# Altium schematic sheet 测试板原理图.SchDoc
size A1
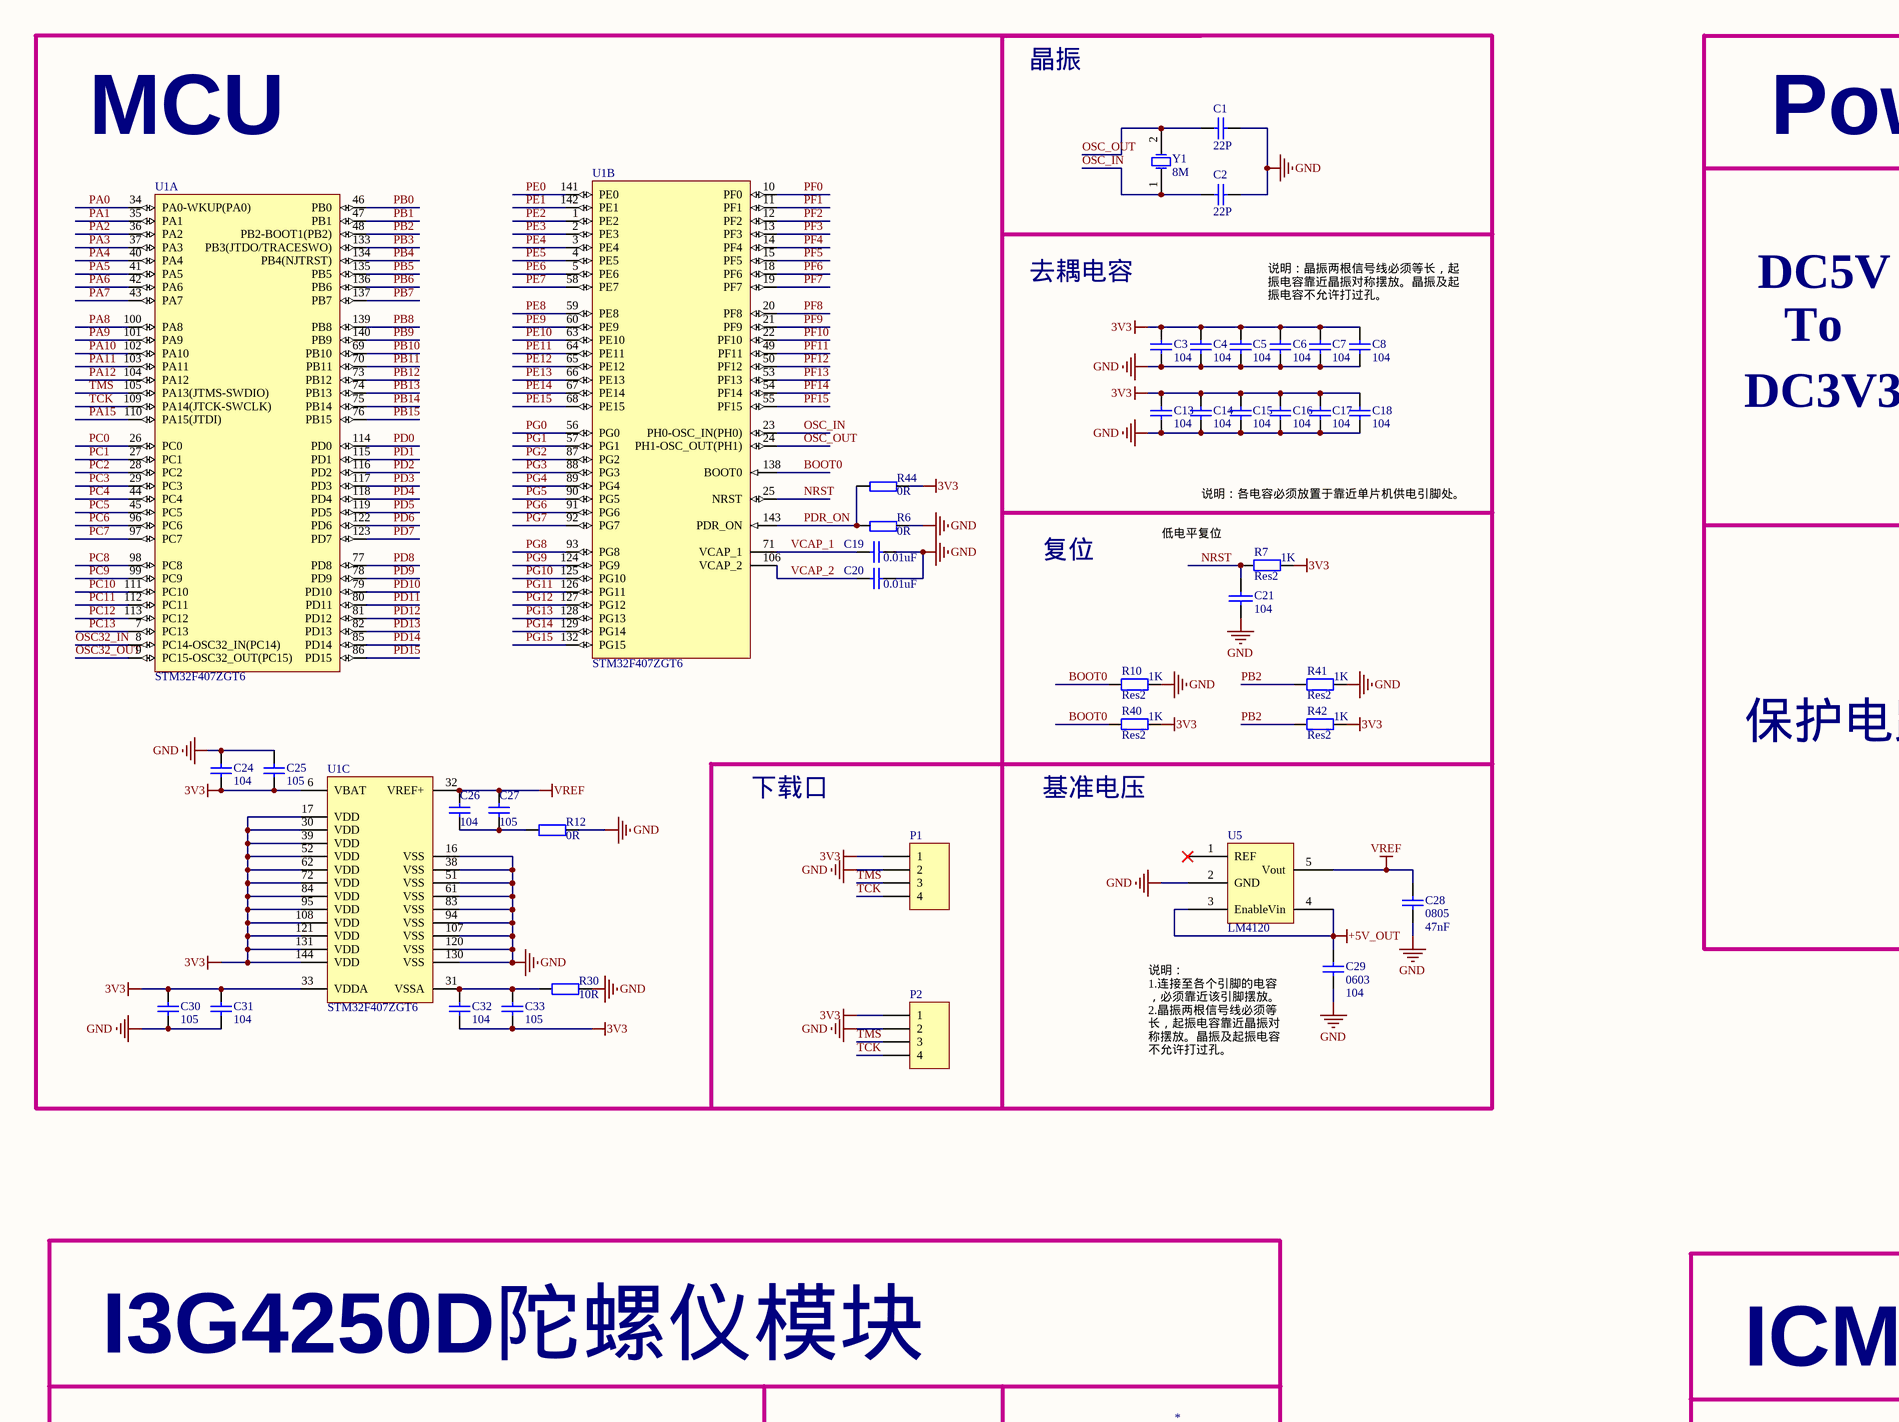
[diagram p0: 测试板原理图.SchDoc, top left]
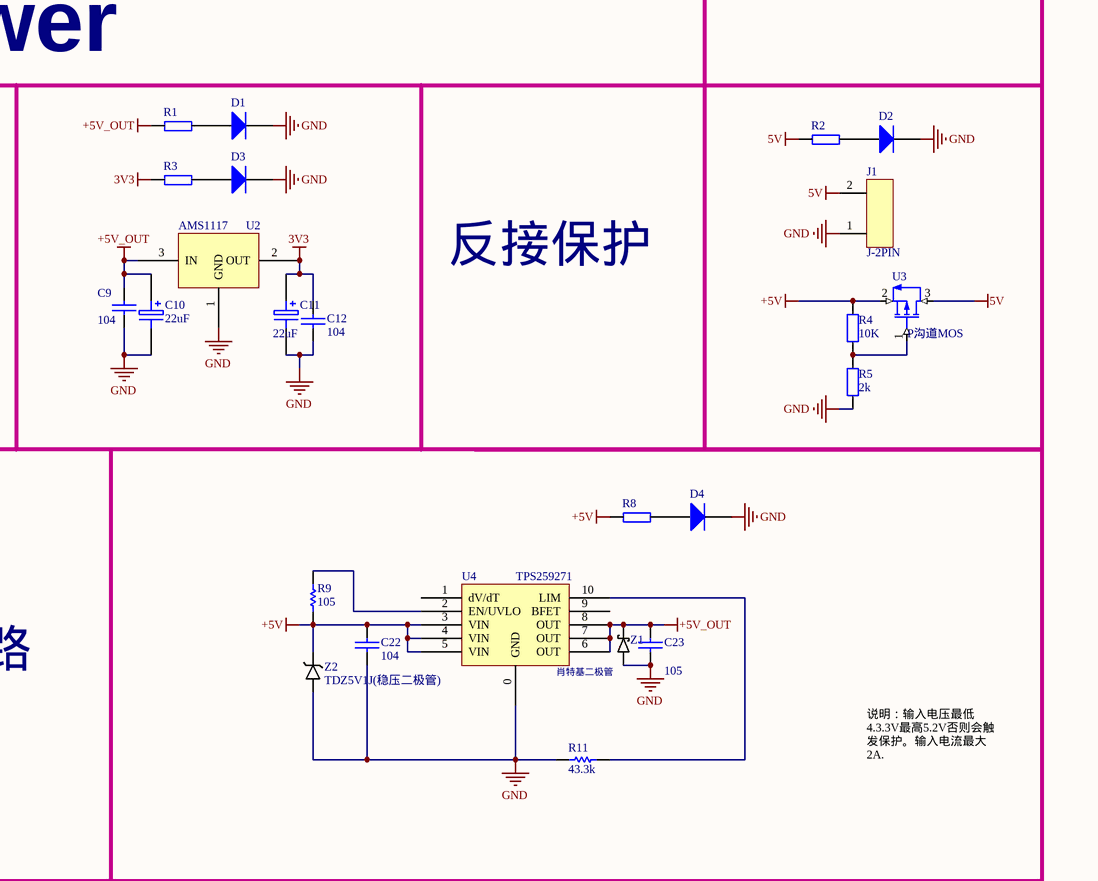
[diagram p1: 测试板原理图.SchDoc, top right]
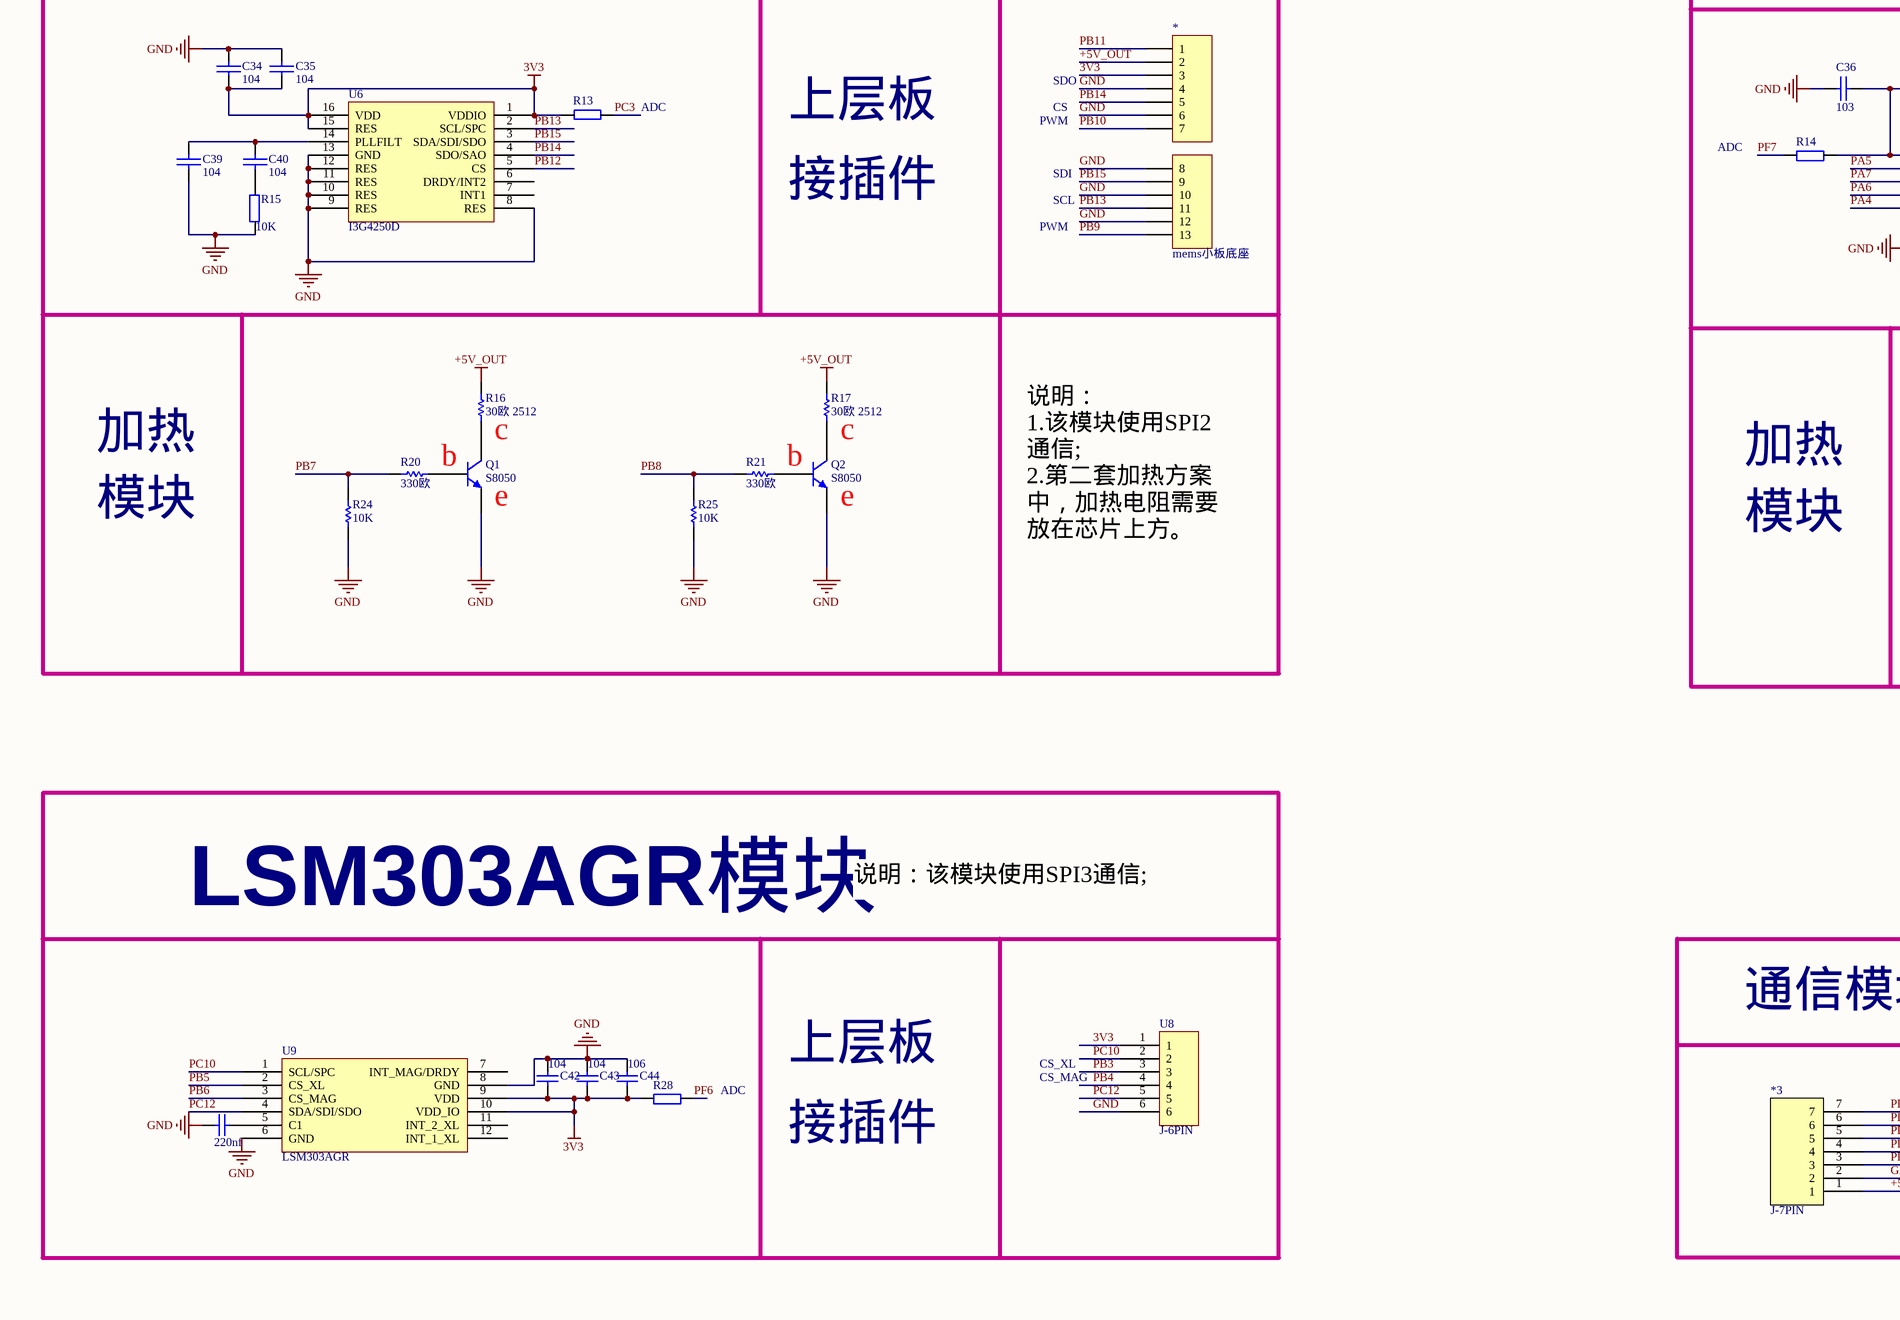
[diagram p2: 测试板原理图.SchDoc, bottom left]
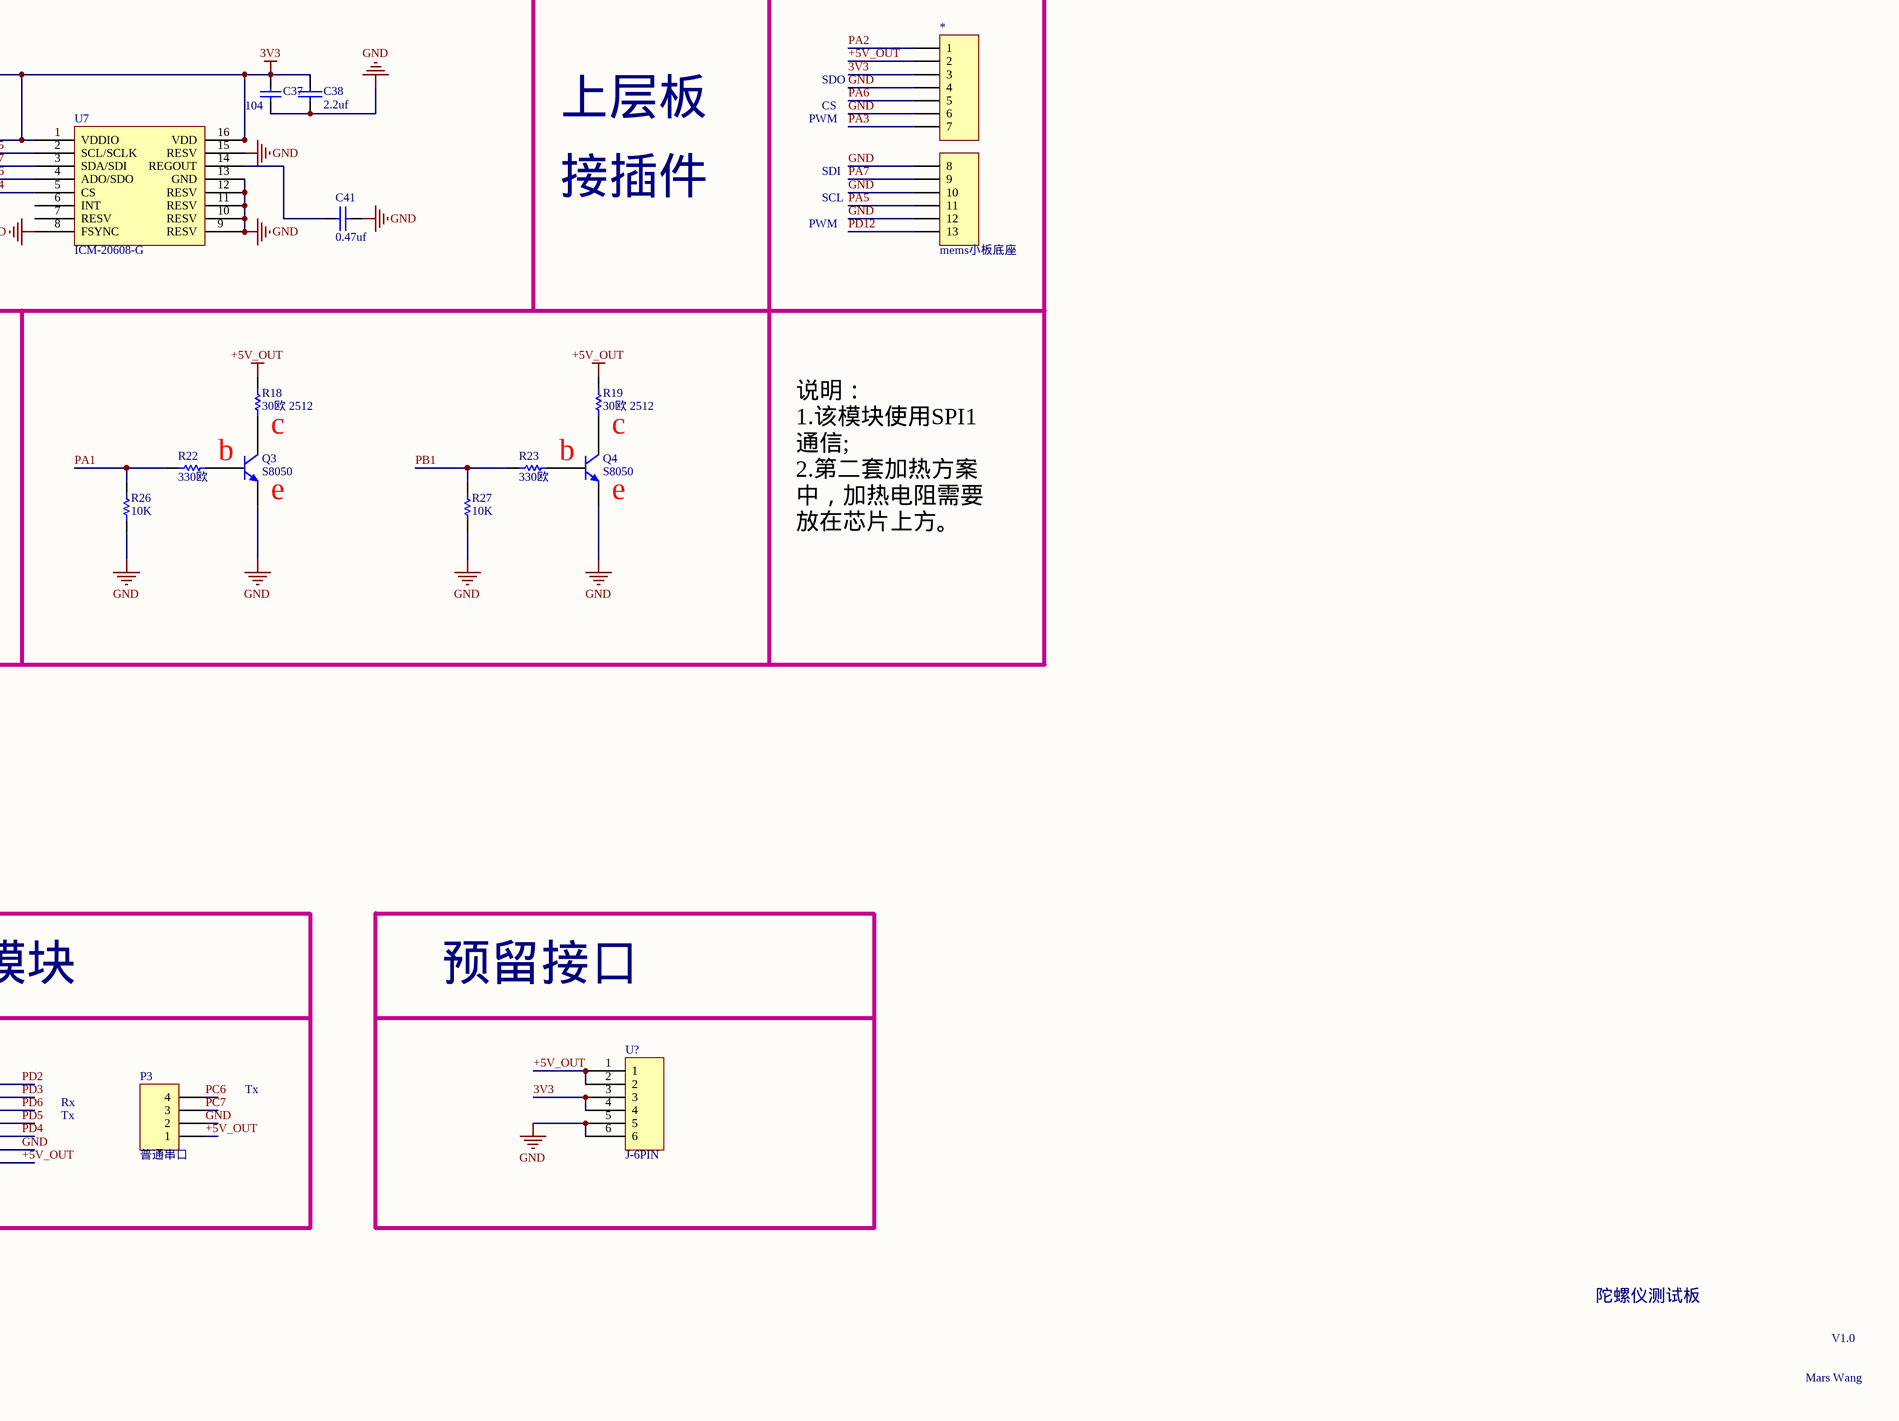
[diagram p3: 测试板原理图.SchDoc, bottom right]

## Parts
(Parts that share a designator on the sheet are numbered #1, #2 ... from top to bottom, then left to right.)
*3  J-7PIN  [HDR1X7排座]
*#1  mems小板底座  [mems小板底座]
*#2  mems小板底座  [mems小板底座]
C1  22P  [C-0603C]
C2  22P  [C-0603C]
C3  104  [C-0603C]
C4  104  [C-0603C]
C5  104  [C-0603C]
C6  104  [C-0603C]
C7  104  [C-0603C]
C8  104  [C-0603C]
C9  104  [C-0603C]
C10  22uF  [C-0603C]
C11  22uF  [C-0603C]
C12  104  [C-0603C]
C13  104  [C-0603C]
C14  104  [C-0603C]
C15  104  [C-0603C]
C16  104  [C-0603C]
C17  104  [C-0603C]
C18  104  [C-0603C]
C19  value 0.01uF  [C-0603C]
C20  value 0.01uF  [C-0603C]
C21  104  [C-0603C]
C22  104  [C-0603C]
C23  105  [C-0603C]
C24  104  [C-0603C]
C25  105  [C-0603C]
C26  104  [C-0603C]
C27  105  [C-0603C]
C28  0805  value 47nF  [C-0603C]
C29  0603  value 104  [C-0603C]
C30  105  [C-0603C]
C31  104  [C-0603C]
C32  104  [C-0603C]
C33  105  [C-0603C]
C34  104  [C-0805C]
C35  104  [C-0805C]
C36  103  [C-0805C]
C37  104  [C-0805C]
C38  2.2uf  [C-0805C]
C39  104  [C-0805C]
C40  104  [C-0805C]
C41  0.47uf  [C-0805C]
C42  104  [C-0805c]
C43  104  [C-0805c]
C44  106  [C-0805C]
C45  220nf  [C-0805C]
D1  (no value)  [D-0603D]
D2  (no value)  [D-0603D]
D3  (no value)  [D-0603D]
D4  (no value)  [D-0603D]
J1  J-2PIN  [J-2-3.81-EDG]
P1  (no value)  [J-4-1.27-molex]
P2  (no value)  [夹式下载口]
P3  普通串口  [HDR1X4排座]
Q1  S8050  [SOT-233-3]
Q2  S8050  [SOT-233-3]
Q3  S8050  [SOT-233-3]
Q4  S8050  [SOT-233-3]
R1  10K  [R-0603R]  (value not drawn)
R2  10K  [R-0603R]  (value not drawn)
R3  10K  [R-0603R]  (value not drawn)
R4  10K  [R-0603R]
R5  value 2k  [R-0603R]  (hidden comment: 22R)
R6  0R  [R-0603R]
R7  Res2  value 1K  [R-0603R]
R8  10K  [R-0603R]  (value not drawn)
R9  105  [R-0603R]
R10  Res2  value 1K  [R-0603R]
R11  43.3k  [R-0603R]
R12  value 0R  [R-0603R]  (hidden comment: 22R)
R13  0R  [R-0603R]  (value not drawn)
R14  0R  [R-0603R]  (value not drawn)
R15  10K  [R-0603R]
R16  30欧 2512  [R-3925R（锰铜）]
R17  30欧 2512  [30欧大电阻]
R18  30欧 2512  [R-3925R（锰铜）]
R19  30欧 2512  [30欧大电阻]
R20  330欧  [R-0603R]
R21  330欧  [R-0603R]
R22  330欧  [R-0603R]
R23  330欧  [R-0603R]
R24  10K  [R-0603R]
R25  10K  [R-0603R]
R26  10K  [R-0603R]
R27  10K  [R-0603R]
R28  0R  [R-0603R]  (value not drawn)
R30  value 10R  [R-0603R]  (hidden comment: 22R)
R40  Res2  value 1K  [R-0603R]
R41  Res2  value 1K  [R-0603R]
R42  Res2  value 1K  [R-0603R]
R44  0R  [R-0603R]
U1  STM32F407ZGT6  [STM-LQFP144_N]  (parts A,B,C of 3)
U2  AMS1117  [sot-223]
U3  P沟道MOS  [SOT-233-3]
U4  TPS259271  [vson]
U5  LM4120  [SOT-235]
U6  I3G4250D  [I3G4250D]
U7  ICM-20608-G  [ICM20608-G]
U8  J-6PIN  [HDR1X6排座]
U9  LSM303AGR  [LSM电子罗盘]
U?  J-6PIN  [HDR1X6排座]
Y1  8M  [X-HC49S]
Z1  肖特基二极管  [肖特基]
Z2  TDZ5V1J(稳压二极管)  [TDZ5V1J]

## Blocks framed on the sheet
MCU: C1-C8 C13-C21 C24-C33 P1 P2 R6 R7 R10 R12 R30 R40-R42 R44 U1 U5 Y1
Power: C9-C12 D1-D3 J1 R1-R5 U2 U3
I3G4250D陀螺仪模块: *#1 C34 C35 C39 C40 Q1 Q2 R13 R15-R17 R20 R21 R24 R25 U6
ICM20608-G陀螺仪模块: *#2 C36-C38 C41 Q3 Q4 R14 R18 R19 R22 R23 R26 R27 U7
LSM303AGR模块: C42-C45 R28 U8 U9
通信模块: *3 P3
预留接口: U?

## Nets
3V3: *#1.3 *#2.3 C3.2 C4.2 C5.2 C6.2 C7.2 C8.2 C11.1 C12.1 C13.2 C14.2 C15.2 C16.2 C17.2 C18.2 C24.1 C25.1 C30.1 C31.1 C32.1 C33.1 C34.2 C35.2 C36.1 C37.1 C38.2 C42.2 C43.2 C44.2 P1.1 P2.1 R3.1 R7.2 R13.2 R14.2 R28.1 R40.2 R42.2 R44.2 U1.6(VBAT) U1.17(VDD) U1.30(VDD) U1.33(VDDA) U1.39(VDD) U1.52(VDD) U1.62(VDD) U1.72(VDD) U1.84(VDD) U1.95(VDD) U1.108(VDD) U1.121(VDD) U1.131(VDD) U1.144(VDD) U2.2(OUT) U6.1(VDDIO) U6.15(RES) U6.16(VDD) U7.1(VDDIO) U7.16(VDD) U8.1 U9.9(VDD) U9.10(VDD_IO) U?.3 U?.4
5V: J1.2 R2.1 U3.3(D)
+5V: C22.1 R4.1 R8.1 R9.2 U3.2(S) U4.3(VIN) U4.4(VIN) U4.5(VIN) Z2.1
+5V_OUT: *3.1 *#1.2 *#2.2 C9.1 C10.1 C23.1 C29.2 P3.1 R1.1 R16.2 R17.2 R18.2 R19.2 U2.3(IN) U4.6(OUT) U4.7(OUT) U4.8(OUT) U5.3(Enable) U5.4(Vin) U?.1 U?.2 Z1.1
GND: *3.2 *#1.4 *#1.6 *#1.8 *#1.10 *#1.12 *#2.4 *#2.6 *#2.8 *#2.10 *#2.12 C1.2 C2.2 C3.1 C4.1 C5.1 C6.1 C7.1 C8.1 C9.2 C10.2 C11.2 C12.2 C13.1 C14.1 C15.1 C16.1 C17.1 C18.1 C19.1 C20.1 C21.2 C22.2 C23.2 C24.2 C25.2 C28.1 C29.1 C30.2 C31.2 C34.1 C35.1 C36.2 C37.2 C38.1 C39.2 C41.1 C42.1 C43.1 C44.1 C45.2 D1.2(K) D2.2(K) D3.2(K) D4.2(K) J1.1 P1.2 P2.2 P3.2 Q1.3(E) Q2.3(E) Q3.3(E) Q4.3(E) R5.2 R6.2 R10.2 R11.2 R12.2 R15.2 R24.1 R25.1 R26.1 R27.1 R30.2 R41.2 U1.16(VSS) U1.38(VSS) U1.51(VSS) U1.61(VSS) U1.83(VSS) U1.94(VSS) U1.107(VSS) U1.120(VSS) U1.130(VSS) U2.1(GND) U4.0(GND) U5.2(GND) U6.8(RES) U6.9(RES) U6.10(RES) U6.11(RES) U6.12(RES) U6.13(GND) U7.8(FSYNC) U7.9(RESV) U7.10(RESV) U7.11(RESV) U7.12(RESV) U7.13(GND) U7.15(RESV) U8.6 U9.6(GND) U9.8(GND) U?.5 U?.6 Z1.2 Z2.2
VREF: C26.2 C27.2 C28.2 U1.32(VREF+) U5.5(Vout)
BOOT0: R10.1 R40.1 U1.138(BOOT0)
NRST: C21.1 R7.1 U1.25(NRST)
OSC32_IN: U1.8(PC14-OSC32_IN(PC14))
OSC32_OUT: U1.9(PC15-OSC32_OUT(PC15))
OSC_IN: C2.1 U1.23(PH0-OSC_IN(PH0)) Y1.1(OSC1)
OSC_OUT: C1.1 U1.24(PH1-OSC_OUT(PH1)) Y1.2(OSC2)
PA0: U1.34(PA0-WKUP(PA0))
PA1: R22.1 R26.2 U1.35(PA1)
PA2: *#2.1 U1.36(PA2)
PA3: *#2.7 U1.37(PA3)
PA4: U1.40(PA4) U7.5(CS)
PA5: *#2.11 U1.41(PA5) U7.2(SCL/SCLK)
PA6: *#2.5 U1.42(PA6) U7.4(ADO/SDO)
PA7: *#2.9 U1.43(PA7) U7.3(SDA/SDI)
PA8: U1.100(PA8)
PA9: U1.101(PA9)
PA10: U1.102(PA10)
PA11: U1.103(PA11)
PA12: U1.104(PA12)
PA15: U1.110(PA15(JTDI))
PB0: U1.46(PB0)
PB1: R23.1 R27.2 U1.47(PB1)
PB2: R41.1 R42.1 U1.48(PB2-BOOT1(PB2))
PB3: U1.133(PB3(JTDO/TRACESWO)) U8.3
PB4: U1.134(PB4(NJTRST)) U8.4
PB5: U1.135(PB5) U9.2(CS_XL)
PB6: U1.136(PB6) U9.3(CS_MAG)
PB7: R20.1 R24.2 U1.137(PB7)
PB8: R21.1 R25.2 U1.139(PB8)
PB9: *#1.13 U1.140(PB9)
PB10: *#1.7 U1.69(PB10)
PB11: *#1.1 U1.70(PB11)
PB12: U1.73(PB12) U6.5(CS)
PB13: *#1.11 U1.74(PB13) U6.2(SCL/SPC)
PB14: *#1.5 U1.75(PB14) U6.4(SDO/SAO)
PB15: *#1.9 U1.76(PB15) U6.3(SDA/SDI/SDO)
PC0: U1.26(PC0)
PC1: U1.27(PC1)
PC2: U1.28(PC2)
PC3: R13.1 U1.29(PC3)
PC4: U1.44(PC4)
PC5: U1.45(PC5)
PC6: P3.4 U1.96(PC6)
PC7: P3.3 U1.97(PC7)
PC8: U1.98(PC8)
PC9: U1.99(PC9)
PC10: U1.111(PC10) U8.2 U9.1(SCL/SPC)
PC11: U1.112(PC11)
PC12: U1.113(PC12) U8.5 U9.4(SDA/SDI/SDO)
PC13: U1.7(PC13)
PD0: U1.114(PD0)
PD1: U1.115(PD1)
PD2: *3.7 U1.116(PD2)
PD3: *3.6 U1.117(PD3)
PD4: *3.3 U1.118(PD4)
PD5: *3.4 U1.119(PD5)
PD6: *3.5 U1.122(PD6)
PD7: U1.123(PD7)
PD8: U1.77(PD8)
PD9: U1.78(PD9)
PD10: U1.79(PD10)
PD11: U1.80(PD11)
PD12: *#2.13 U1.81(PD12)
PD13: U1.82(PD13)
PD14: U1.85(PD14)
PD15: U1.86(PD15)
PDR_ON: R6.1 R44.1 U1.143(PDR_ON)
PE0: U1.141(PE0)
PE1: U1.142(PE1)
PE2: U1.1(PE2)
PE3: U1.2(PE3)
PE4: U1.3(PE4)
PE5: U1.4(PE5)
PE6: U1.5(PE6)
PE7: U1.58(PE7)
PE8: U1.59(PE8)
PE9: U1.60(PE9)
PE10: U1.63(PE10)
PE11: U1.64(PE11)
PE12: U1.65(PE12)
PE13: U1.66(PE13)
PE14: U1.67(PE14)
PE15: U1.68(PE15)
PF0: U1.10(PF0)
PF1: U1.11(PF1)
PF2: U1.12(PF2)
PF3: U1.13(PF3)
PF4: U1.14(PF4)
PF5: U1.15(PF5)
PF6: R28.2 U1.18(PF6)
PF7: R14.1 U1.19(PF7)
PF8: U1.20(PF8)
PF9: U1.21(PF9)
PF10: U1.22(PF10)
PF11: U1.49(PF11)
PF12: U1.50(PF12)
PF13: U1.53(PF13)
PF14: U1.54(PF14)
PF15: U1.55(PF15)
PG0: U1.56(PG0)
PG1: U1.57(PG1)
PG2: U1.87(PG2)
PG3: U1.88(PG3)
PG4: U1.89(PG4)
PG5: U1.90(PG5)
PG6: U1.91(PG6)
PG7: U1.92(PG7)
PG8: U1.93(PG8)
PG9: U1.124(PG9)
PG10: U1.125(PG10)
PG11: U1.126(PG11)
PG12: U1.127(PG12)
PG13: U1.128(PG13)
PG14: U1.129(PG14)
PG15: U1.132(PG15)
TCK: P1.4 P2.4 U1.109(PA14(JTCK-SWCLK))
TMS: P1.3 P2.3 U1.105(PA13(JTMS-SWDIO))
VCAP_1: C19.2 U1.71(VCAP_1)
VCAP_2: C20.2 U1.106(VCAP_2)
NetC26_1: C26.1 C27.1 R12.1
NetC32_2: C32.2 C33.2 R30.1 U1.31(VSSA)
NetC39_1: C39.1 C40.2 U6.14(PLLFILT)
NetC40_1: C40.1 R15.1
NetC41_2: C41.2 U7.14(REGOUT)
NetC45_1: C45.1 U9.5(C1)
NetD1_1: D1.1(A) R1.2
NetD2_1: D2.1(A) R2.2
NetD3_1: D3.1(A) R3.2
NetD4_1: D4.1(A) R8.2
NetQ1_1: Q1.1(C) R16.1
NetQ1_2: Q1.2(B) R20.2
NetQ2_1: Q2.1(C) R17.1
NetQ2_2: Q2.2(B) R21.2
NetQ3_1: Q3.1(C) R18.1
NetQ3_2: Q3.2(B) R22.2
NetQ4_1: Q4.1(C) R19.1
NetQ4_2: Q4.2(B) R23.2
NetR4_2: R4.2 R5.1 U3.1(G)
NetR9_1: R9.1 U4.2(EN/UVLO)
NetR11_1: R11.1 U4.10(LIM)

Not connected (* = marked no-connect by the designer): U4 1(dV/dT) 9(BFET); U5 1(REF)*; U6 6(DRDY/INT2) 7(INT1); U7 6(INT) 7(RESV); U9 7(INT_MAG/DRDY) 11(INT_2_XL) 12(INT_1_XL)

## Notes on the sheet
- 晶振
- 去耦电容
- 说明：晶振两根信号线必须等长，起振电容靠近晶振对称摆放。晶振及起振电容不允许打过孔。
- DC5V
- To
- 反接保护
- DC3V3
- (near R7) 低电平复位
- 说明：各电容必须放置于靠近单片机供电引脚处。
- 复位
- 保护电路
- 下载口
- 基准电压
- 说明：输入电压最低4.3.3V最高5.2V否则会触发保护。输入电流最大2A.
- 说明：
  1.连接至各个引脚的电容，必须靠近该引脚摆放。
  2.晶振两根信号线必须等长，起振电容靠近晶振对称摆放。晶振及起振电容不允许打过孔。
- SDO
- (near R13) ADC
- 上层板
- PWM
- CS
- ADC
- 接插件
- SCL
- SDI
- 加热
- b
- c
- 模块
- (near Q1) e
- (near Q2) e
- (near Q3) e
- (near Q4) e
- 说明：
  1.该模块使用SPI2通信;
  2.第二套加热方案中，加热电阻需要放在芯片上方。
- 说明：
  1.该模块使用SPI1通信;
  2.第二套加热方案中，加热电阻需要放在芯片上方。
- 说明：该模块使用SPI3通信;
- CS_XL
- CS_MAG
- (near R28) ADC
- Rx
- Tx
- 陀螺仪测试板
- Mars Wang
- V1.0

## Library data of the parts
C1-C8 C13-C18 C24-C27 C30-C33 = Cap: Capacitor; Value: 100pF; Published: 8-Jun-2000; LatestRevisionDate: 17-Jul-2002; LatestRevisionNote: Re-released for DXP Platform.; PackageReference: RAD-0.3; Publisher: Altium Limited
C9 C12 C22 C23 = CAP: Capacitor
  C23: value: 105
C10 C11 = ELECTRO1: Electrolytic Capacitor
C19 C20 C28 C29 C37 C42-C45 = Cap: Capacitor; Published: 8-Jun-2000; LatestRevisionDate: 17-Jul-2002; LatestRevisionNote: Re-released for DXP Platform.; PackageReference: RAD-0.3; Publisher: Altium Limited
  C42 C43: Value: 104
  C44: Value: 106
  C45: Value: 220nf
C21 C34-C36 C38-C41 = C-贴片电容: Capacitor
D1-D4 = D-发光二极管: Default Diode; Published: 8-Jun-2000; LatestRevisionDate: 17-Jul-2002; LatestRevisionNote: Re-released for DXP Platform.; PackageDocument: Sep-1996; PackageReference: SMC; Publisher: Altium Limited; Code_JEDEC: DO-214-AB
J1 = J-2PIN: SOCKET
P1 P2 = Header 4: Header, 4-Pin; LatestRevisionDate: 17-Jul-2002; LatestRevisionNote: Re-released for DXP Platform.; Publisher: Altium Limited
P3 = J-4PIN: Header, 4-Pin; LatestRevisionDate: 17-Jul-2002; LatestRevisionNote: Re-released for DXP Platform.; Publisher: Altium Limited
Q1-Q4 = NPN: NPN Bipolar Transistor; Published: 8-Jun-2000; LatestRevisionDate: 17-Jul-2002; LatestRevisionNote: Re-released for DXP Platform.; PackageReference: TO-226; Publisher: Altium Limited; Code_JEDEC: TO-226-AA
R1-R3 R6 R8 R13 R14 R28 R44 = Resistor: RES, 10K, 5%, 0.1 W, 0603
R4 R5 R7 R10 R12 R30 R40-R42 = Res2: Resistor; Published: 8-Jun-2000; LatestRevisionDate: 17-Jul-2002; LatestRevisionNote: Re-released for DXP Platform.; PackageReference: AXIAL-0.4; Publisher: Altium Limited
  R4: Value: 10K
R9 R11 R16-R27 = Res Semi: Semiconductor Resistor; Published: 8-Jun-2000; LatestRevisionDate: 17-Jul-2002; LatestRevisionNote: Re-released for DXP Platform.; PackageReference: AXIAL-0.5; Publisher: Altium Limited; PackageDescription: Axial Device, Thru-Hole; 2 Leads; 0.5 in Pin Spacing
  R9: Value: 105
  R11: Value: 43.3k
  R16-R19: Value: 30欧 2512
  R20-R23: Value: 330欧
  R24-R27: Value: 10K
R15 = Resistor
U1 = STM32F407ZGT6: ARM Cortex-M4 32-bit MCU+FPU, 210 DMIPS, 1024 kB Flash, 192 kB Internal RAM, 114 I/Os, 144-pin LQFP, -40 to 85 degC, Tray; Manufacturer: STMicroelectronics; D/A Converter: 2x12-bit; FLASH Size (Prog) (kB): 1024; I/Os (High Current): 114; Internal RAM Size (kB): 192; Operating Frequency(F) (Processor speed) (MHz): 168; Supply Voltage(Vcc) max (V): 3.6; Supply Voltage(Vcc) min (V): 1.8; DatasheetVersion: Rev. 4; PackageVersion: Rev. 4, 06/2013; PackageReference: LQFP144; PackageDescription: 144-Pin Low Profile Quad Flat Package, 20 x 20 mm Body, 0.5 mm Pitch; Supplier 1: Digi-Key; Supplier Part Number 1: 497-11766-ND; Supplier 2: Newark; Supplier Part Number 2: 73T2334; Supplier 3: Mouser; Supplier Part Number 3: 511-STM32F407ZGT6; Core: ARM Cortex-M4; Packing: Tray; Mounting Technology: Surface Mount; PartNumber: STM32F407ZGT6; ComponentLink1Description: Manufacturer URL; ComponentLink1URL: http://www.st.com/web/en/home.html; ComponentLink2Description: Datasheet; ComponentLink2URL: http://www.st.com/st-web-ui/static/active/en/resource/technical/document/datasheet/DM00037051.pdf; ComponentLink3Description: Package Specification; ComponentLink3URL: http://www.st.com/st-web-ui/static/active/en/resource/technical/document/datasheet/DM00037051.pdf
U2 = Component_1
U6 = I3G4250D: gyroscope
U9 = LSM303AGR: e-compass
Y1 = XTAL: Crystal Oscillator; Published: 8-Jun-2000; LatestRevisionDate: 17-Jul-2002; LatestRevisionNote: Re-released for DXP Platform.; PackageReference: R38; Publisher: Altium Limited
Z1 = STPS0520Z(肖特基二极管)